# Altium schematic sheet Main.SchDoc
size A0; SheetNumber: 1; SheetTotal: 1
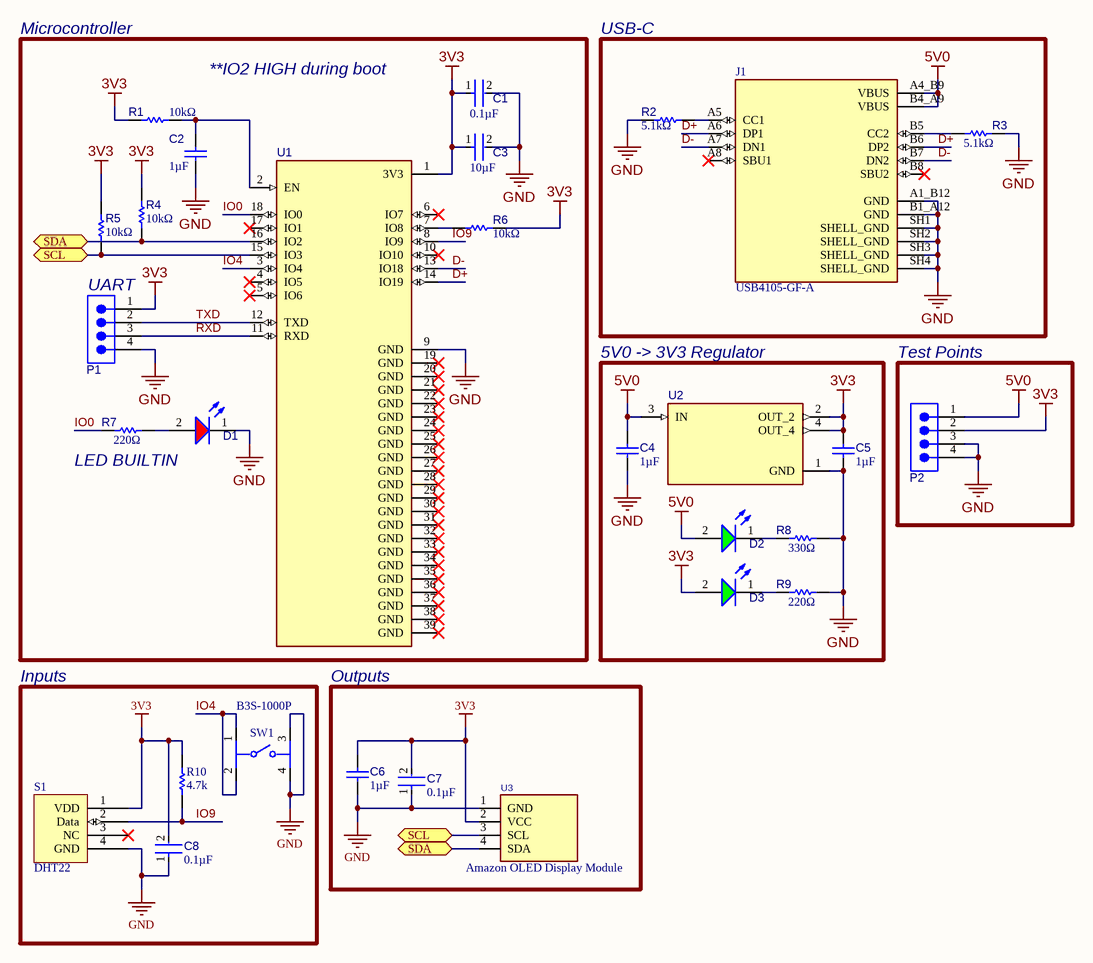
[diagram p0: Main.SchDoc]

## Parts
C1  0.1µF  [FP-C1206C-EB-MFG]
C2  1µF  [CAPC3216X110X50LL20T25]
C3  10µF  [FP-GRM31C-0_2-e0_3_0_8-MFG]
C4  1µF  [CAPC3216X110X50LL20T25]
C5  1µF  [CAPC3216X110X50LL20T25]
C6  1µF  [CAPC3216X110X50LL20T25]
C7  0.1µF  [FP-C1206C-EB-MFG]
C8  0.1µF  [FP-C1206C-EB-MFG]
D1  150120SS75000  [WL-SMCW_1206_150120xx75000]  (value not drawn)
D2  150120GS75000  [WL-SMCW_1206_150120xx75000]  (value not drawn)
D3  150120GS75000  [WL-SMCW_1206_150120xx75000]  (value not drawn)
J1  USB4105-GF-A  [GCT_USB4105-GF-A]
P1  61300411121  [61300411121]  (value not drawn)
P2  61300411121  [61300411121]  (value not drawn)
R1  10kΩ  [RESC3216X70X50LL20T25]
R2  5.1kΩ  [RESC3216X70X50NL05T20]
R3  5.1kΩ  [RESC3216X70X50NL05T20]
R4  10kΩ  [RESC3216X70X50LL20T25]
R5  10kΩ  [RESC3216X70X50LL20T25]
R6  10kΩ  [RESC3216X70X50LL20T25]
R7  220Ω  [RESC3216X70X50ML20T25]
R8  330Ω  [RESC3216X70X50NL05T20]
R9  220Ω  [RESC3216X70X50ML20T25]
R10  4.7k  [RESC3216X70X50LL05T20]
S1  DHT22  [DHT22_Footprint]
SW1  B3S-1000P  [FP-B3S-1000P-MFG]
U1  ESP32-C3-WROOM-02-N4  [MODULE_ESP32-C3-WROOM-02-H4]  (value not drawn)
U2  TLV1117LV33DCYR  [VREG_TLV1117LV33DCYR]  (value not drawn)
U3  Amazon OLED Display Module  [Amazon OLED Display Module]

## Blocks framed on the sheet
USB-C: J1 R2 R3
5V0 -> 3V3 Regulator: C4 C5 D2 D3 R8 R9 U2
Test Points: P2
Inputs: C8 R10 S1 SW1
Outputs: C6 C7 U3

## Ports
SCL (bidir, see Main[7B]), SCL (bidir, see Main[8C]), SDA (bidir, see Main[7B]), SDA (bidir, see Main[8C])

## Nets
3V3: C1.1 C3.1 C5.2 C6.2 C7.2 C8.2 D3.2(A) P1.1 P2.2 R1.1 R4.2 R5.2 R6.2 R10.2 S1.1(VDD) U1.1(3V3) U2.2(OUT_2) U2.4(OUT_4) U3.2(VCC)
5V0: C4.2 D2.2(A) J1.A4_B9(VBUS) J1.B4_A9(VBUS) P2.1 U2.3(IN)
GND: C1.2 C2.1 C3.2 C4.1 C5.1 C6.1 C7.1 C8.1 D1.1(K) J1.A1_B12(GND) J1.B1_A12(GND) J1.SH1(SHELL_GND) J1.SH2(SHELL_GND) J1.SH3(SHELL_GND) J1.SH4(SHELL_GND) P1.4 P2.3 P2.4 R2.1 R3.2 R8.2 R9.2 S1.4(GND) SW1.3 SW1.4 U1.9(GND) U2.1(GND) U3.1(GND)
D+: J1.A6(DP1) J1.B6(DP2) U1.14(IO19)
D-: J1.A7(DN1) J1.B7(DN2) U1.13(IO18)
IO0: R7.1 U1.18(IO0)
IO4: SW1.1 SW1.2 U1.3(IO4)
IO9: R10.1 S1.2(Data) U1.8(IO9)
RXD: P1.3 U1.11(RXD)
SCL: R5.1 U1.15(IO3) U3.3(SCL) ; port SCL
SDA: R4.1 U1.16(IO2) U3.4(SDA) ; port SDA
TXD: P1.2 U1.12(TXD)
NetC2_2: C2.2 R1.2 U1.2(EN)
NetD1_2: D1.2(A) R7.2
NetD2_1: D2.1(K) R8.1
NetD3_1: D3.1(K) R9.1
NetJ1_A5: J1.A5(CC1) R2.2
NetJ1_B5: J1.B5(CC2) R3.1
NetR6_1: R6.1 U1.7(IO8)

Not connected (* = marked no-connect by the designer): J1 A8(SBU1)* B8(SBU2)*; S1 3(NC)*; U1 4(IO5)* 5(IO6)* 6(IO7)* 10(IO10)* 17(IO1)* 19(GND)* 20(GND)* 21(GND)* 22(GND)* 23(GND)* 24(GND)* 25(GND)* 26(GND)* 27(GND)* 28(GND)* 29(GND)* 30(GND)* 31(GND)* 32(GND)* 33(GND)* 34(GND)* 35(GND)* 36(GND)* 37(GND)* 38(GND)* 39(GND)*

## Notes on the sheet
- Microcontroller
- **IO2 HIGH during boot
- (near P1) UART
- LED BUILTIN

## Library data of the parts
C1 C7 C8 = CMP-03020-000153-1: CAP CER 0.1UF 100V X7R 1206; Manufacturer: KEMET; Manufacturer Part Number: C1206C104K1RACTU; Value: 0.10 μF; Tolerance: 0.1; Material: Ceramic; Temperature Coefficient: 15%; Automotive Grade: Grade 0; Voltage Rating: 100 V; Automotive: Yes; Ipc Land Pattern Name: CAPC320160X78; Device Class L1: Passive Components; ComponentLink2Description: Datasheet; Temperature Range Low: -55°C; Category: Cap; Octopart: https://octopart.com/c1206c104k1ractu-kemet-89521; Height: 0.88mm; Lead Free: Yes; Digikey Description: CAP CER 0.1UF 100V X7R 1206; Mouser Description: CAP CER 0.1UF 100V X7R 1206; Device Class L3: Ceramic Capacitors; Device Class L2: Capacitors; ComponentLink2URL: https://content.kemet.com/datasheets/KEM_C1007_X8R_ULTRA_150C_SMD.pdf; Temperature Range High: +150°C; Temperature Characteristic: X7R; RoHS: TRUE; Capacitance: 0.10 μF; Package: C1206C-EB; Temperature: -55°C to +150°C
C2 C4-C6 = CMP-2000-06011-1: Chip Capacitor, 1 uF, +/- 10%, 50 V, -55 to 125 degC, 1206 (3216 Metric), RoHS, Tape and Reel; Manufacturer: Kemet; Case Height: 1mm; Dielectric: X7R; Voltage Rating: 50V; Capacitance: 1uF; Temperature Coefficient / Code: +/-15%; Case Length: 3.2mm; Case Width: 1.6mm; Type: SMDMLCCX7R6.3-250VDCCommericalGrade; Class: Class1; Capacitance - nF: 1000nF; Datasheet URL: http://www.kemet.com/docfinder?Partnumber=C1206C105K5RACTU; Product Category: MultilayerCeramicCapacitorsMLCC-SMD/SMT; Termination Style: SMD/SMT; Dimensions: 1.6mmWx3.2mmLx1mmH; Voltage Rating DC: 50V; Datasheet Version: 02/2016; Packaging: Reel; Brand: Kemet; RoHS: Details; Minimum Operating Temperature: -55C; Operating Temperature Range: -55Cto+125C; Package Reference: 1206; Manufacturer URL: http://www.kemet.com/; Product: GeneralTypeMLCCs; Tolerance: 10%; Package Description: 2-Pin Surface Mount Device, Body 3.2 x 1.6 mm; Mounting Technology: SurfaceMount; Case Code - mm: 3216; Maximum Operating Temperature: +125C; Series: C1206C; Factory Pack Quantity: 2500; Package / Case: 1206(3216metric); Case Code - in: 1206
C3 = CMP-06035-003589-1: Chip Multilayer Ceramic Capacitors for General Purpose, 1206, 10uF, X7R, 15%, 10%, 25V; Case Code (Imperial): 1206; Voltage Rating (DC): 25V; Voltage Rating: 25V; Length: 3.2mm; Lead Free: Lead Free; Thickness: 0.071inch; Package Quantity: 1; Width: 1.6mm; Max Operating Temperature: 125°C; Number of Pins: 2; Height: 1.6mm; Case Code (Metric): 3216; REACH SVHC: No SVHC; Radiation Hardening: No; Case/Package: 1206; Material: Ceramic; Tolerance: 10%; Voltage: 25V; Mount: Surface Mount; Packaging: Tape and Reel; Dielectric: X7R; Termination: SMD/SMT; Min Operating Temperature: -55°C; Capacitance: 10uF; Depth: 1.6mm
D1 = CMP-1426-00017-3: Led, Red, 630 Nm, 1.9 V, 30 Ma, 60 Mcd Rohs Compliant: Yes; Forward Current: 100mA; Max Reverse Voltage (DC): 5V; Lens Style: Clear, Rectangular; Viewing Angle: 140°; Luminous Intensity: 60mcd; Peak Wavelength: 645nm; Forward Voltage: 1.9V; Test Current: 20mA; Dominant Wavelength: 630nm; Case Code (Imperial): 1206; Length: 3.2mm; Mount: Surface Mount; Case Code (Metric): 3216; Case/Package: 1206; Min Operating Temperature: -40°C; Width: 1.6mm; Color: Red; Height: 680µm; REACH SVHC: Unknown; Max Operating Temperature: 85°C; Wavelength: 630nm; RoHS: Compliant; Packaging: Tape and Reel
D2 D3 = CMP-1426-00014-4: WL-SMCW SMT Mono-Color Chip LED Waterclear; Dominant Wavelength: 525nm; Reverse Voltage: 5V; Max Junction Temperature (Tj): 95°C; Lens Style: Clear, Rectangular; Forward Voltage: 3.2V; Power Dissipation: 105mW; Peak Wavelength: 515nm; Test Current: 20mA; Color: Green; Forward Current: 100mA; Luminous Intensity: 450mcd; Viewing Angle: 140°; Case Code (Imperial): 1206; REACH SVHC: Unknown; Packaging: Tape and Reel; Max Operating Temperature: 85°C; Case/Package: 1206; Height: 680µm; Length: 3.2mm; Mount: Surface Mount; Min Operating Temperature: -40°C; Width: 1.6mm; Case Code (Metric): 3216; Max Reverse Voltage (DC): 5V; RoHS: Compliant; Wavelength: 525nm
J1 = USB4105-GF-A: MF: {'manufacturer': u'GCT'}; Package: None; Price: None; Value: *; MP: USB4105-GF-A; Availability: Unavailable
P1 P2 = 61300411121: WR-PHD Pin Header, THT, Vertical, pitch 2.54mm, 1 Row, 4P; Manufacturer: Wurth Elektronik; Contact Resistance: 20mOhm; Rated Current: 3A; Working Voltage: 250V; Withstanding Voltage: 500V; Manufacturer Part Number: 61300411121; Category: Board-to-Board Connectors; Match Code: WR-PHD; ComponentLink1Description: Website Link; ComponentLink1URL: https://www.we-online.com/redexpert/article/61300411121?ad; ComponentLink2Description: Datasheet Link; ComponentLink2URL: https://www.we-online.com/redexpert/spec/61300411121?ad; Mount: Through Hole; Operating Temperature Max: 105°C; Operating Temperature Min: -40°C; Packaging: Bag; Gender: Pin Header; Number of Pins: 4; Number of Rows: 1; Orientation: Vertical; Pitch: 2.54mm
R1 R4-R6 = CMP-2003-04407-1: Manufacturer: Panasonic; Part Number: ERA8AEB103V
R2 R3 = CMP-2003-00853-1: Part Number: ERJ-8ENF5101V; Manufacturer: Panasonic
R7 R9 = CMP-2003-04438-1: Part Number: ERA8AEB221V; Manufacturer: Panasonic
R8 = CMP-2003-00612-1: Manufacturer: Panasonic; Part Number: ERJ-8GEYJ331V
R10 = CMP-2003-00848-1: Part Number: ERJ8ENF4701V; Manufacturer: Panasonic
S1 = DHT22: DHT22 Sensor
SW1 = CMP-08834-000008-1: SWITCH TACTILE SPST-NO 0.05A 24V; Throw Configuration: SPST; Switch Function: Off-Mom; Switch Travel: 0.25mm; Contact Current Rating: 50mA; Actuator Length: 0.8mm; Mechanical Life: 500000Cycles; Contact Resistance: 100mR; Operating Force: 1.57N; Actuator Type: Standard; Illumination Type: Non-Illuminated; Ratings: IP67; Number of Poles: 1; Package Quantity: 1; Orientation: Straight; REACH SVHC: No SVHC; Lead Free: Lead Free; Max Current Rating: 50mA; Contact Plating: Silver; Current Rating: 50mA; Depth: 9mm; Contact Material: Bronze; Electrical Life: 500000Cycles; Termination: Gull Wing; Width: 6mm; Packaging: Tape and Reel; Min Operating Temperature: -25°C; Radiation Hardening: No; Max Voltage Rating (DC): 24V; Max Operating Temperature: 70°C; Length: 6.6mm; Height: 3.65mm; Voltage Rating (DC): 24V; Weight: 0.010582oz; Mount: Surface Mount
U1 = ESP32-C3-WROOM-02-N4: WiFi Modules (802.11) (Engineering Samples) SMD module, ESP32-C3, 4MB SPI flash, PCB antenna, -40 C +85 C; MF: Espressif Systems; Value: *; SnapEDA_Link: https://www.snapeda.com/parts/ESP32-C3-WROOM-02-N4/Espressif+Systems/view-part/?ref=snap; Purchase-URL: https://pricing.snapeda.com/search/part/ESP32-C3-WROOM-02-N4/?ref=eda; Availability: In Stock; Price: None; Package: Package; Check_prices: https://www.snapeda.com/parts/ESP32-C3-WROOM-02-N4/Espressif+Systems/view-part/?ref=eda; MP: ESP32-C3-WROOM-02-N4
U2 = TLV1117LV33DCYR: 1-A, low-dropout voltage regulator; MF: Texas Instruments; Check_prices: https://www.snapeda.com/parts/TLV1117LV33DCYR/Texas+Instruments/view-part/?ref=eda; Value: *; MP: TLV1117LV33DCYR; Purchase-URL: https://pricing.snapeda.com/search/part/TLV1117LV33DCYR/?ref=eda; SnapEDA_Link: https://www.snapeda.com/parts/TLV1117LV33DCYR/Texas+Instruments/view-part/?ref=snap; Package: SOT-223-4 Texas Instruments; Digi-Key_Part_Number: 296-28778-2-ND
U3 = CMP-00256-A.5: Hosyond 5 Pcs 0.96 Inch OLED I2C Display Module 128x64 Pixel OLED Display; Amazon Link: https://www.amazon.com/dp/B09C5K91H7?ref=ppx_yo2ov_dt_b_product_details&th=1; Parameter 1: *